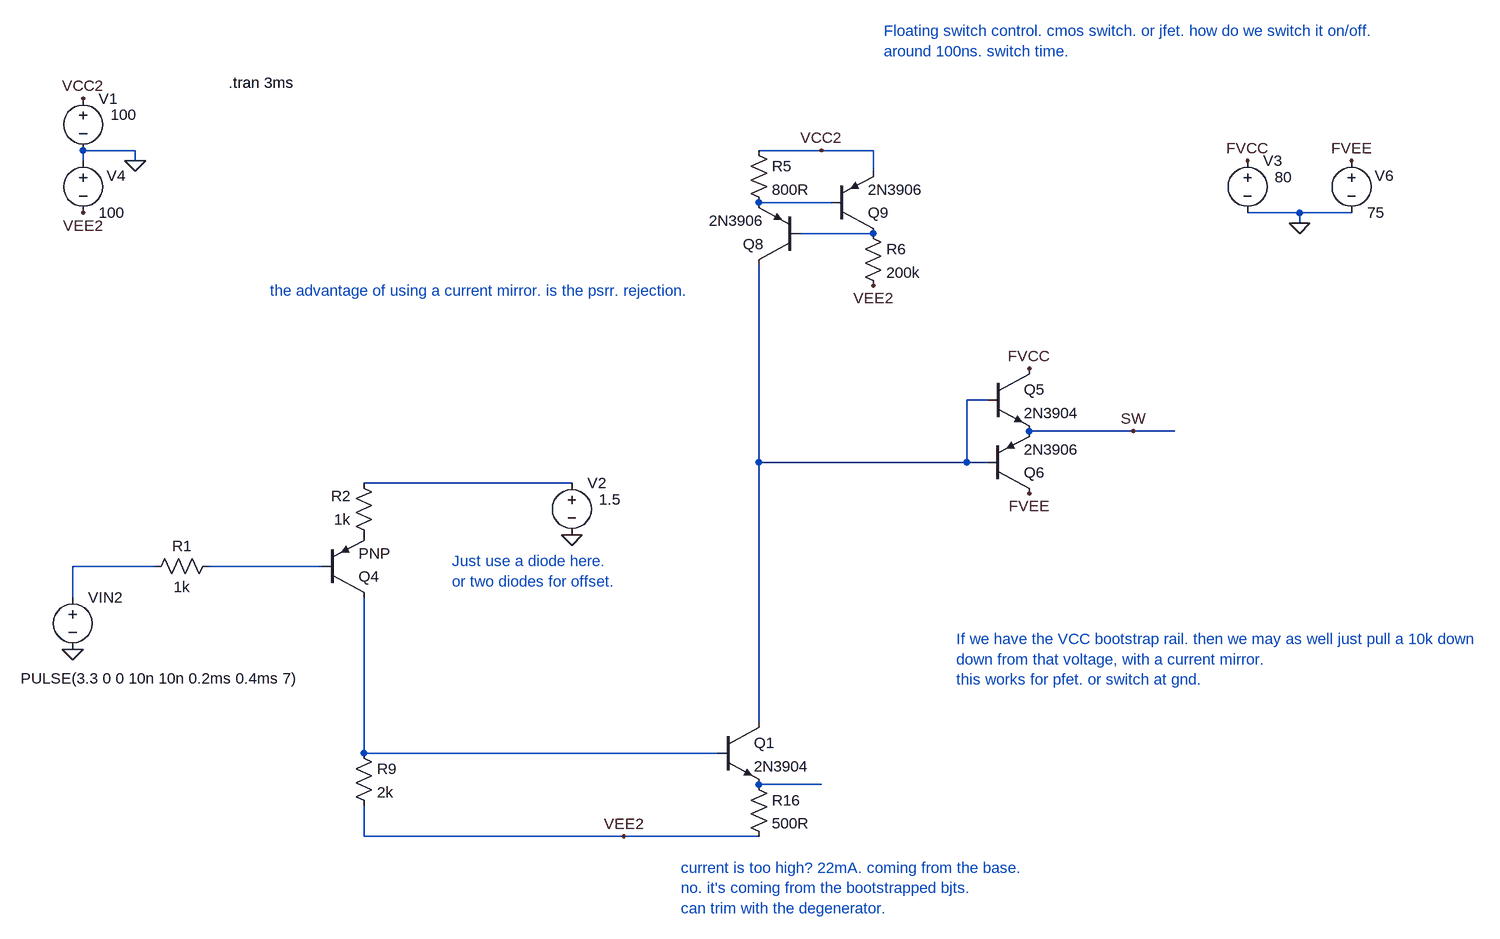
[diagram p0: schematic Draft53.asc]
Draft53.asc, the LTspice schematic file:
Version 4
SHEET 1 2336 952
WIRE -256 -288 -336 -288
WIRE 800 -288 704 -288
WIRE 880 -288 800 -288
WIRE -336 -272 -336 -288
WIRE -256 -272 -256 -288
WIRE 880 -256 880 -288
WIRE 816 -208 704 -208
WIRE 1536 -192 1456 -192
WIRE 1616 -192 1536 -192
WIRE 1536 -176 1536 -192
WIRE 880 -160 768 -160
WIRE 1056 96 1024 96
WIRE 1280 144 1120 144
WIRE 1344 144 1280 144
WIRE 704 192 704 -112
WIRE 1024 192 1024 96
WIRE 1024 192 704 192
WIRE 1056 192 1024 192
WIRE 416 224 96 224
WIRE -224 352 -352 352
WIRE 32 352 -144 352
WIRE -352 400 -352 352
WIRE 704 592 704 192
WIRE 96 640 96 400
WIRE 640 640 96 640
WIRE 800 688 704 688
WIRE 96 768 96 720
WIRE 496 768 96 768
WIRE 704 768 496 768
FLAG -256 -272 0
FLAG -336 -368 VCC2
FLAG -336 -192 VEE2
FLAG 496 768 VEE2
FLAG -352 480 0
FLAG 800 -288 VCC2
FLAG 880 -80 VEE2
FLAG 416 304 0
FLAG 1536 -176 0
FLAG 1456 -272 FVCC
FLAG 1616 -272 FVEE
FLAG 1120 48 FVCC
FLAG 1120 240 FVEE
FLAG 1280 144 SW
SYMBOL voltage -336 -384 R0
WINDOW 123 0 0 Left 0
WINDOW 39 0 0 Left 0
WINDOW 3 42 41 Left 2
SYMATTR Value 100
SYMATTR InstName V1
SYMBOL voltage -336 -288 R0
WINDOW 123 0 0 Left 0
WINDOW 39 0 0 Left 0
WINDOW 0 36 39 Left 2
SYMATTR InstName V4
SYMATTR Value 100
SYMBOL npn 1056 48 R0
SYMATTR InstName Q5
SYMATTR Value 2N3904
SYMBOL pnp 1056 240 M180
SYMATTR InstName Q6
SYMATTR Value 2N3906
SYMBOL res 80 624 R0
SYMATTR InstName R9
SYMATTR Value 2k
SYMBOL res 688 672 R0
SYMATTR InstName R16
SYMATTR Value 500R
SYMBOL pnp 32 400 M180
SYMATTR InstName Q4
SYMBOL voltage -352 384 R0
WINDOW 123 0 0 Left 0
WINDOW 39 0 0 Left 0
WINDOW 3 -80 141 Left 2
SYMATTR Value PULSE(3.3 0 0 10n 10n 0.2ms 0.4ms 7)
SYMATTR InstName VIN2
SYMBOL res -128 336 R90
WINDOW 0 0 56 VBottom 2
WINDOW 3 32 56 VTop 2
SYMATTR InstName R1
SYMATTR Value 1k
SYMBOL npn 640 592 R0
SYMATTR InstName Q1
SYMATTR Value 2N3904
SYMBOL pnp 768 -112 R180
SYMATTR InstName Q8
SYMATTR Value 2N3906
SYMBOL pnp 816 -160 M180
SYMATTR InstName Q9
SYMATTR Value 2N3906
SYMBOL res 688 -304 R0
SYMATTR InstName R5
SYMATTR Value 800R
SYMBOL res 864 -176 R0
SYMATTR InstName R6
SYMATTR Value 200k
SYMBOL voltage 416 208 R0
WINDOW 123 0 0 Left 0
WINDOW 39 0 0 Left 0
WINDOW 3 42 41 Left 2
SYMATTR Value 1.5
SYMATTR InstName V2
SYMBOL voltage 1456 -288 R0
WINDOW 123 0 0 Left 0
WINDOW 39 0 0 Left 0
WINDOW 3 42 41 Left 2
SYMATTR Value 80
SYMATTR InstName V3
SYMBOL voltage 1616 -288 R0
WINDOW 123 0 0 Left 0
WINDOW 39 0 0 Left 0
WINDOW 0 36 39 Left 2
SYMATTR InstName V6
SYMATTR Value 75
SYMBOL res 112 320 R180
WINDOW 0 36 76 Left 2
WINDOW 3 36 40 Left 2
SYMATTR InstName R2
SYMATTR Value 1k
TEXT -112 -392 Left 2 !.tran 3ms
TEXT 896 -472 Left 2 ;Floating switch control. cmos switch. or jfet. how do we switch it on/off.\naround 100ns. switch time.
TEXT 232 344 Left 2 ;Just use a diode here. \nor two diodes for offset.
TEXT 584 816 Left 2 ;current is too high? 22mA. coming from the base.\nno. it's coming from the bootstrapped bjts.\ncan trim with the degenerator.
TEXT -48 -72 Left 2 ;the advantage of using a current mirror. is the psrr. rejection.
TEXT 1008 464 Left 2 ;If we have the VCC bootstrap rail. then we may as well just pull a 10k down\ndown from that voltage, with a current mirror.\nthis works for pfet. or switch at gnd.

The netlist it stands for:
* Draft53.asc
V1 VCC2 0 100
V4 0 VEE2 100
Q5 FVCC N003 SW 0 2N3904
Q6 FVEE N003 SW 0 2N3906
R9 N007 VEE2 2k
R16 N008 VEE2 500R
Q4 N007 N006 P001 0 PNP
VIN2 N005 0 PULSE(3.3 0 0 10n 10n 0.2ms 0.4ms 7)
R1 N006 N005 1k
Q1 N003 N007 N008 0 2N3904
Q8 N003 N002 N001 0 2N3906
Q9 N002 N001 VCC2 0 2N3906
R5 VCC2 N001 800R
R6 N002 VEE2 200k
V2 N004 0 1.5
V3 FVCC 0 80
V6 FVEE 0 75
R2 P001 N004 1k
.model NPN NPN
.model PNP PNP
.lib standard.bjt
.tran 3ms
* Floating switch control. cmos switch. or jfet. how do we switch it on/off.
* around 100ns. switch time.
* Just use a diode here.
* or two diodes for offset.
* current is too high? 22mA. coming from the base.
* no. it's coming from the bootstrapped bjts.
* can trim with the degenerator.
* the advantage of using a current mirror. is the psrr. rejection.
* If we have the VCC bootstrap rail. then we may as well just pull a 10k down
* down from that voltage, with a current mirror.
* this works for pfet. or switch at gnd.
.backanno
.end